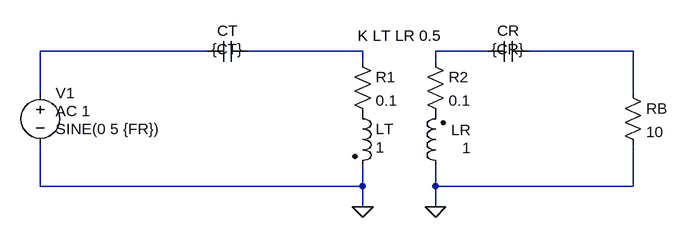
[diagram p0: schematic WPTSIM.asc]
WPTSIM.asc, the LTspice schematic file:
Version 4
SHEET 1 1000 692
WIRE 288 48 32 48
WIRE 528 48 352 48
WIRE 720 48 640 48
WIRE 944 48 784 48
WIRE 528 64 528 48
WIRE 640 64 640 48
WIRE 32 112 32 48
WIRE 944 112 944 48
WIRE 32 256 32 192
WIRE 528 256 528 224
WIRE 528 256 32 256
WIRE 640 256 640 224
WIRE 944 256 944 192
WIRE 944 256 640 256
WIRE 528 288 528 256
WIRE 640 288 640 256
FLAG 528 288 0
FLAG 640 288 0
SYMBOL voltage 32 96 R0
WINDOW 123 24 44 Left 2
WINDOW 39 0 0 Left 0
WINDOW 3 24 72 Left 2
SYMATTR Value2 AC 1
SYMATTR Value SINE(0 5 {FR})
SYMATTR InstName V1
SYMBOL cap 288 64 R270
WINDOW 0 32 32 VTop 2
WINDOW 3 4 32 VTop 2
SYMATTR InstName CT
SYMATTR Value {CT}
SYMBOL ind2 512 128 R0
WINDOW 3 36 68 Left 2
SYMATTR Value 1
SYMATTR InstName LT
SYMATTR Type ind
SYMBOL res 512 48 R0
SYMATTR InstName R1
SYMATTR Value 0.1
SYMBOL ind2 656 240 R180
WINDOW 0 -39 71 Left 2
WINDOW 3 -39 43 Left 2
SYMATTR InstName LR
SYMATTR Value 1
SYMATTR Type ind
SYMBOL res 624 48 R0
SYMATTR InstName R2
SYMATTR Value 0.1
SYMBOL cap 784 32 R90
WINDOW 0 0 32 VBottom 2
WINDOW 3 28 32 VBottom 2
SYMATTR InstName CR
SYMATTR Value {CR}
SYMBOL res 928 96 R0
SYMATTR InstName RB
SYMATTR Value 10
TEXT 520 24 Left 2 !K LT LR 0.5

The netlist it stands for:
* WPTSIM.asc
V1 N001 0 SINE(0 5 {FR}) AC 1
CT N001 N002 {CT}
LT P001 0 1
R1 N002 P001 0.1
LR 0 P002 1
R2 N003 P002 0.1
CR N004 N003 {CR}
RB N004 0 10
K LT LR 0.5
.backanno
.end